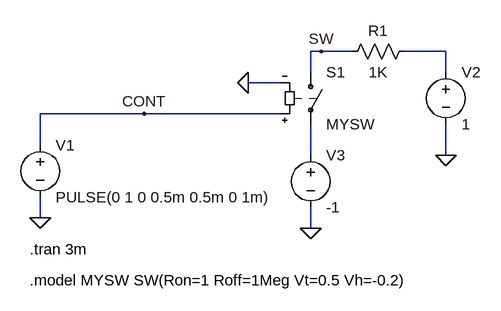
[diagram p0: schematic Fig_2-135_Vswitch-Vh.asc]
Fig_2-135_Vswitch-Vh.asc, the LTspice schematic file:
Version 4
SHEET 1 880 724
WIRE 224 64 208 64
WIRE 272 64 224 64
WIRE 416 64 352 64
WIRE 208 96 208 64
WIRE 416 96 416 64
WIRE 160 112 112 112
WIRE -48 160 -208 160
WIRE 160 160 -48 160
WIRE -208 208 -208 160
WIRE 208 224 208 176
WIRE 416 224 416 176
WIRE -208 320 -208 288
WIRE 208 336 208 304
FLAG 112 112 0
FLAG 416 224 0
FLAG 208 336 0
FLAG -208 320 0
FLAG -48 160 CONT
FLAG 224 64 SW
SYMBOL sw 208 80 R0
SYMATTR InstName S1
SYMATTR Value MYSW
SYMBOL voltage 416 80 R0
WINDOW 123 0 0 Left 2
WINDOW 39 0 0 Left 2
SYMATTR InstName V2
SYMATTR Value 1
SYMBOL voltage -208 192 R0
WINDOW 123 0 0 Left 2
WINDOW 39 0 0 Left 2
SYMATTR InstName V1
SYMATTR Value PULSE(0 1 0 0.5m 0.5m 0 1m)
SYMBOL voltage 208 208 R0
WINDOW 123 0 0 Left 2
WINDOW 39 0 0 Left 2
SYMATTR InstName V3
SYMATTR Value -1
SYMBOL res 256 80 R270
WINDOW 0 32 56 VTop 2
WINDOW 3 0 56 VBottom 2
SYMATTR InstName R1
SYMATTR Value 1K
TEXT -224 416 Left 2 !.model MYSW SW(Ron=1 Roff=1Meg Vt=0.5 Vh=-0.2)
TEXT -224 368 Left 2 !.tran 3m

The netlist it stands for:
* Fig_2-135_Vswitch-Vh.asc
S1 SW N002 CONT 0 MYSW
V2 N001 0 1
V1 CONT 0 PULSE(0 1 0 0.5m 0.5m 0 1m)
V3 N002 0 -1
R1 SW N001 1K
.model MYSW SW(Ron=1 Roff=1Meg Vt=0.5 Vh=-0.2)
.tran 3m
.backanno
.end